# Altium schematic sheet ArduinoUnoShield.SchDoc
size A4
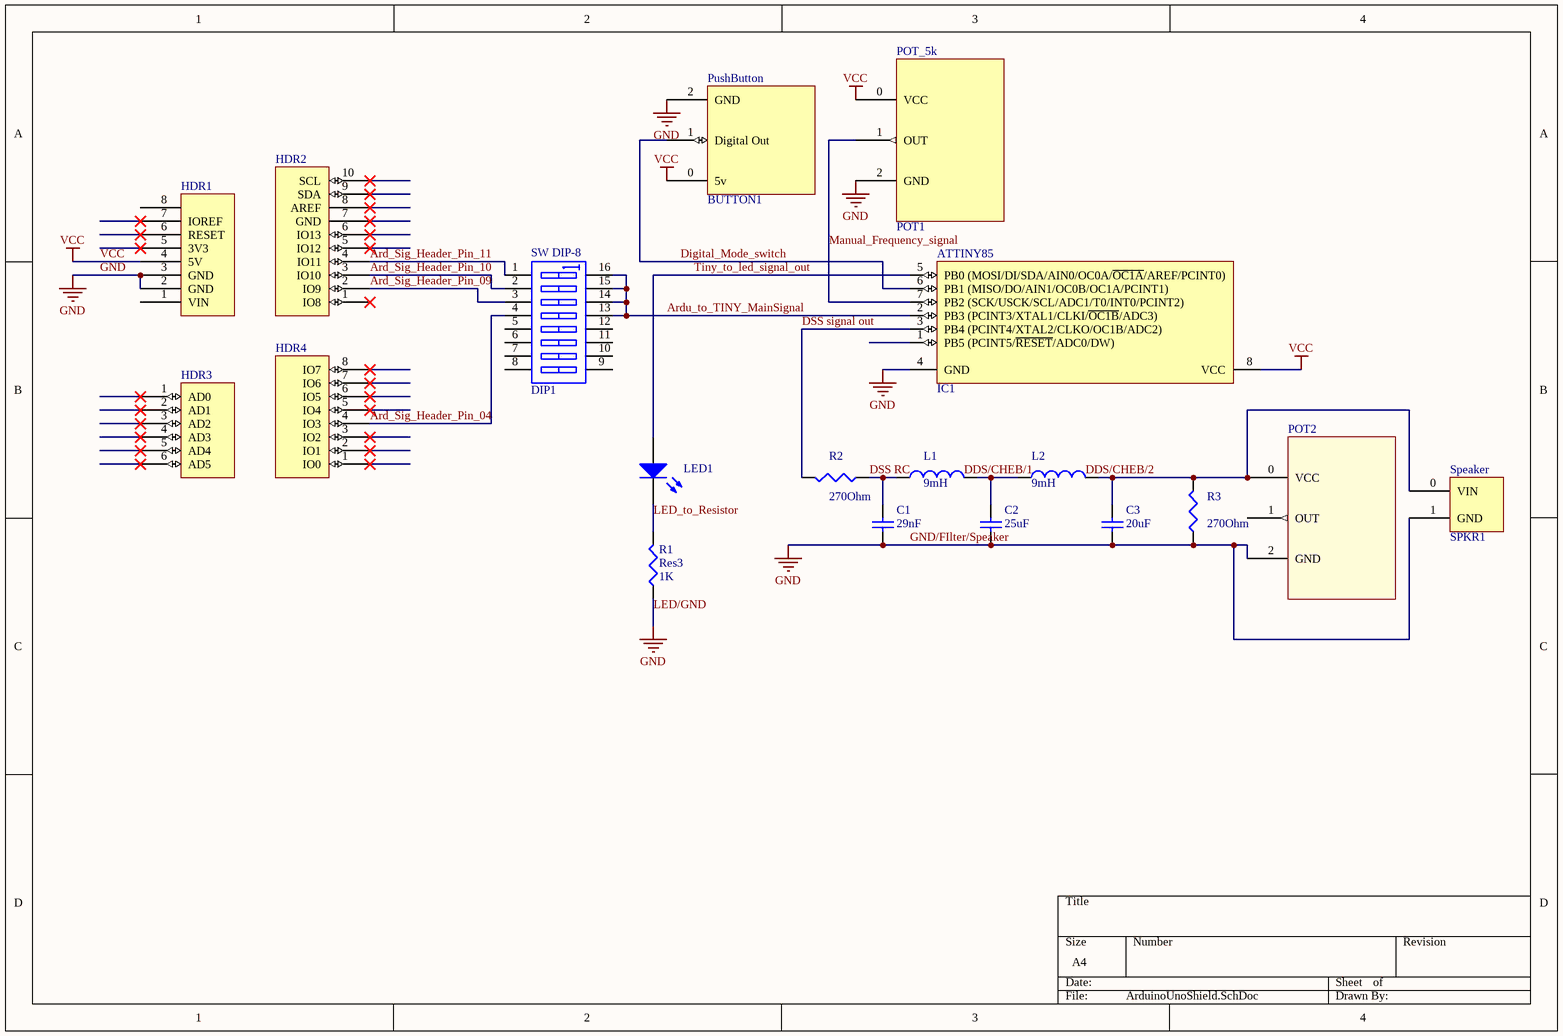
[diagram p0: ArduinoUnoShield.SchDoc]

## Parts
ATTINY85  IC1  [DIP-8]
C1  value 29nF  [1608[0603]]  (hidden comment: Cap Semi)
C2  value 25uF  [1608[0603]]  (hidden comment: Cap Semi)
C3  value 20uF  [1608[0603]]  (hidden comment: Cap Semi)
HDR1  POWER_UNO  [Header 8x1 8.5mm]  (value not drawn)
HDR2  IOH  [Header 10x1 8.5mm]  (value not drawn)
HDR3  AD  [Header 6x1 8.5mm]  (value not drawn)
HDR4  IOL  [Header 8x1 8.5mm]  (value not drawn)
L1  value 9mH  [AXIAL-0.3]  (hidden comment: Inductor)
L2  value 9mH  [AXIAL-0.3]  (hidden comment: Inductor)
LED1  LED1  [LED-1]  (value not drawn)
POT2  Component_1  [POT Footprint_Rev_1]  (value not drawn)
POT_5k  POT1  [POT Footprint_Rev_1]
PushButton  BUTTON1  [PushButtonFrame]
R1  Res3  value 1K  [J1-0603]
R2  value 270Ohm  [J1-0603]  (hidden comment: Res3)
R3  value 270Ohm  [J1-0603]  (hidden comment: Res3)
Speaker  SPKR1  [PCBComponent_1]
SW_DIP-8  DIP1  [DIP_SW_8WAY_SMD]

## Nets
GND: ATTINY85.4(GND) C1.1 C2.1 C3.1 HDR1.2(GND) HDR1.3(GND) POT2.2(GND) POT_5k.2(GND) PushButton.2(GND) R1.1 R3.1 Speaker.1(GND)  [also labelled GND/FIlter/Speaker, LED/GND]
VCC: ATTINY85.8(VCC) HDR1.4(5V) POT_5k.0(VCC) PushButton.0(5v)
Ard_Sig_Header_Pin_04: HDR4.4(IO3) SW_DIP-8.4(A4)
Ard_Sig_Header_Pin_09: HDR2.2(IO9) SW_DIP-8.3(A3)
Ard_Sig_Header_Pin_10: HDR2.3(IO10) SW_DIP-8.2(A2)
Ard_Sig_Header_Pin_11: HDR2.4(IO11) SW_DIP-8.1(A1)
Ardu_to_TINY_MainSignal: ATTINY85.2(PB3_(PCINT3/XTAL1/CLKI/~{OC1B}/ADC3)) SW_DIP-8.13(B4) SW_DIP-8.14(B3) SW_DIP-8.15(B2) SW_DIP-8.16(B1)
Digital_Mode_switch: ATTINY85.6(PB1_(MISO/DO/AIN1/OC0B/OC1A/PCINT1)) PushButton.1(Digital_Out)
DSS RC: C1.2 L1.1 R2.1
DSS signal out: ATTINY85.3(PB4_(PCINT4/XTAL2/CLKO/OC1B/ADC2)) R2.2
LED_to_Resistor: LED1.2(K) R1.2
Manual_Frequency_signal: ATTINY85.7(PB2_(SCK/USCK/SCL/ADC1/T0/INT0/PCINT2)) POT_5k.1(OUT)
Tiny_to_led_signal_out: ATTINY85.5(PB0_(MOSI/DI/SDA/AIN0/OC0A/~{OC1A}/AREF/PCINT0)) LED1.1(A)
NetC2_2: C2.2 L1.2 L2.1
NetC3_2: C3.2 L2.2 POT2.0(VCC) R3.2 Speaker.0(VIN)

Not connected (* = marked no-connect by the designer): ATTINY85 1(PB5_(PCINT5/~{RESET}/ADC0/DW)); HDR1 1(VIN) 5(3V3)* 6(RESET)* 7(IOREF)* 8; HDR2 1(IO8)* 5(IO12)* 6(IO13)* 7(GND)* 8(AREF)* 9(SDA)* 10(SCL)*; HDR3 1(AD0)* 2(AD1)* 3(AD2)* 4(AD3)* 5(AD4)* 6(AD5)*; HDR4 1(IO0)* 2(IO1)* 3(IO2)* 5(IO4)* 6(IO5)* 7(IO6)* 8(IO7)*; POT2 1(OUT); SW_DIP-8 5(A5) 6(A6) 7(A7) 8(A8) 9(B8) 10(B7) 11(B6) 12(B5)

## Notes on the sheet
- Labels drawn without touching a wire or pin: DDS/CHEB/1, DDS/CHEB/2

## Library data of the parts
ATTINY85 = ATtiny85-20PU: Low Power tinyAVR® 8-Bit Microcontroller, 8K Flash Memory, 20MHz, Industrial Temperature, 8-Lead PDIP, Pb-Free; Published: 20-Nov-2009; DatasheetVersion: DOC2586I, May-2008; PackageVersion: revB, Jan-2002; PackageReference: 8P3; Publisher: Altium Limited; PackageDescription: 8-Lead, 0.300" Wide Body, Plastic Dual In-Line Package (PDIP); Supplier 1: Digi-Key; Supplier Part Number 1: ATTINY85-20PU-ND; Supplier 2: Farnell; Supplier Part Number 2: 1455162; Supplier 3: Mouser; Supplier Part Number 3: 556-ATTINY85-20PU; Code_JEDEC: MS-001-BA; ComponentLink1Description: Manufacturer Link; ComponentLink1URL: http://www.atmel.com/products/AVR/tinyavr.asp?; ComponentLink2Description: Datasheet; ComponentLink2URL: http://www.atmel.com/dyn/resources/prod_documents/doc2586.pdf; ComponentLink3Description: Atmel.com Home; ComponentLink3URL: http://www.atmel.com
C1-C3 = Cap Semi: Capacitor (Semiconductor SIM Model); Published: 8-Jun-2000; LatestRevisionDate: 29-May-2009; LatestRevisionNote: IPC-7351 Footprint Added.; PackageReference: C1206; Publisher: Altium Limited; PackageDescription: Chip Capacitor
L1 L2 = Inductor: Code_IEC: 1005; Published: 8-Jun-2000; LatestRevisionDate: 29-May-2009; LatestRevisionNote: IPC-7351 Footprint Added.; PackageReference: 0402-A; Publisher: Altium Limited; PackageDescription: Chip Inductor; Code_JEITA: 0402
LED1 = LED1: Typical RED GaAs LED; Published: 8-Jun-2000; LatestRevisionDate: 08-Jul-2005; LatestRevisionNote: Mech Layer 1 removed.; PackageReference: LED-1; Publisher: Altium Limited; PackageDescription: LED; 2 Leads
POT2 POT_5k = Component_1: 5k RES
PushButton = PushButton
R1-R3 = Res3: Resistor; Published: 8-Jun-2000; LatestRevisionDate: 29-May-2009; LatestRevisionNote: IPC-7351 Footprint Added.; PackageReference: J1-0603; Publisher: Altium Limited; PackageDescription: Chip Resistor
Speaker = Component_1
SW_DIP-8 = SW DIP-8: DIP Switch, 8 Position, SPST; Published: 24-Mar-1999; LatestRevisionDate: 17-Jul-2002; LatestRevisionNote: Re-released for DXP Platform.; PackageReference: DIP_SW_8WAY_SMD; Publisher: Altium Limited; PackageDescription: DIP Switch; 16 Leads
HDR1 = POWER_UNO: Supplier 1: Arrow; Supplier Part Number 1: 2698925; Supplier 2: Digi-Key; Supplier Part Number 2: SAM1198-08-ND; Supplier 3: Arrow; Supplier Part Number 3: 2698940
HDR2 = IOH: Supplier 1: Arrow; Supplier Part Number 1: 2698789; Supplier 2: Arrow; Supplier Part Number 2: 2698803S4475693N1004; Supplier 3: Digi-Key; Supplier Part Number 3: SAM1198-10-ND
HDR3 = AD: Supplier 1: Arrow; Supplier Part Number 1: 52553843; Supplier 2: Arrow; Supplier Part Number 2: 2699089; Supplier 3: Digi-Key; Supplier Part Number 3: SAM1198-06-ND; Supplier 4: Newark; Supplier Part Number 4: 11P8269
HDR4 = IOL: Supplier 1: Arrow; Supplier Part Number 1: 2698925; Supplier 2: Arrow; Supplier Part Number 2: 2698940; Supplier 3: Digi-Key; Supplier Part Number 3: SAM1198-08-ND